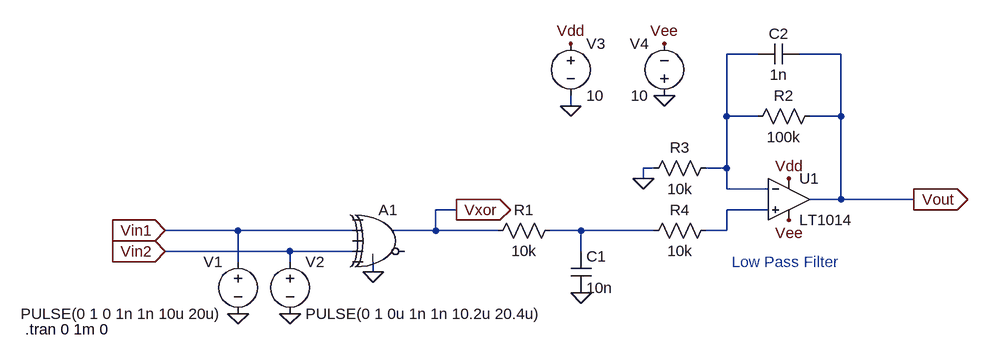
[diagram p0: schematic XOR phase detector.asc]
XOR phase detector.asc, the LTspice schematic file:
Version 4
SHEET 1 1552 680
WIRE 736 -128 688 -128
WIRE 864 -128 800 -128
WIRE 448 -48 448 -64
WIRE 688 -32 688 -128
WIRE 736 -32 688 -32
WIRE 864 -32 864 -128
WIRE 864 -32 816 -32
WIRE 576 48 560 48
WIRE 688 48 688 -32
WIRE 688 48 656 48
WIRE 560 64 560 48
WIRE 688 80 688 48
WIRE 752 80 688 80
WIRE 864 96 864 -32
WIRE 864 96 816 96
WIRE 976 96 864 96
WIRE 272 112 240 112
WIRE 752 112 688 112
WIRE -64 144 -176 144
WIRE 112 144 -64 144
WIRE 240 144 240 112
WIRE 240 144 176 144
WIRE 336 144 240 144
WIRE 464 144 416 144
WIRE 576 144 464 144
WIRE 688 144 688 112
WIRE 688 144 656 144
WIRE 16 176 -176 176
WIRE 112 176 16 176
WIRE 464 176 464 144
WIRE -64 192 -64 144
WIRE 16 192 16 176
WIRE 144 208 144 192
FLAG 144 208 0
FLAG -64 272 0
FLAG 16 272 0
FLAG 464 240 0
FLAG 784 64 Vdd
FLAG 976 96 Vout
IOPIN 976 96 Out
FLAG 784 128 Vee
FLAG 448 -48 0
FLAG 448 -144 Vdd
FLAG 592 -64 0
FLAG 592 -144 Vee
FLAG 560 64 0
FLAG -176 144 Vin1
IOPIN -176 144 In
FLAG -176 176 Vin2
IOPIN -176 176 In
FLAG 272 112 Vxor
IOPIN 272 112 Out
SYMBOL Digital\\xor 160 96 R0
SYMATTR InstName A1
SYMBOL voltage -64 176 M0
WINDOW 123 0 0 Left 0
WINDOW 39 0 0 Left 0
SYMATTR InstName V1
SYMATTR Value PULSE(0 1 0 1n 1n 10u 20u)
SYMBOL voltage 16 176 R0
WINDOW 123 0 0 Left 0
WINDOW 39 0 0 Left 0
SYMATTR InstName V2
SYMATTR Value PULSE(0 1 0u 1n 1n 10.2u 20.4u)
SYMBOL res 432 128 R90
WINDOW 0 0 56 VBottom 2
WINDOW 3 32 56 VTop 2
SYMATTR InstName R1
SYMATTR Value 10k
SYMBOL cap 448 176 R0
SYMATTR InstName C1
SYMATTR Value 10n
SYMBOL Opamps\\LT1014 784 32 R0
SYMATTR InstName U1
SYMBOL res 832 -48 R90
WINDOW 0 0 56 VBottom 2
WINDOW 3 32 56 VTop 2
SYMATTR InstName R2
SYMATTR Value 100k
SYMBOL res 672 32 R90
WINDOW 0 0 56 VBottom 2
WINDOW 3 32 56 VTop 2
SYMATTR InstName R3
SYMATTR Value 10k
SYMBOL res 672 128 R90
WINDOW 0 0 56 VBottom 2
WINDOW 3 32 56 VTop 2
SYMATTR InstName R4
SYMATTR Value 10k
SYMBOL cap 800 -144 R90
WINDOW 0 0 32 VBottom 2
WINDOW 3 32 32 VTop 2
SYMATTR InstName C2
SYMATTR Value 1n
SYMBOL voltage 448 -160 R0
WINDOW 123 0 0 Left 0
WINDOW 39 0 0 Left 0
SYMATTR InstName V3
SYMATTR Value 10
SYMBOL voltage 592 -48 R180
WINDOW 0 24 96 Left 2
WINDOW 3 24 16 Left 2
WINDOW 123 0 0 Left 0
WINDOW 39 0 0 Left 0
SYMATTR InstName V4
SYMATTR Value 10
TEXT -392 296 Left 2 !.tran 0 1m 0
TEXT 696 192 Left 2 ;Low Pass Filter

The netlist it stands for:
* XOR phase detector.asc
A1 0 Vin1 0 Vin2 0 0 Vxor 0 XOR
V1 Vin1 0 PULSE(0 1 0 1n 1n 10u 20u)
V2 Vin2 0 PULSE(0 1 0u 1n 1n 10.2u 20.4u)
R1 N003 Vxor 10k
C1 N003 0 10n
XU1 N002 N001 Vdd Vee Vout LT1014  ; pins In+ In- V+ V- OUT
R2 Vout N001 100k
R3 N001 0 10k
R4 N002 N003 10k
C2 Vout N001 1n
V3 Vdd 0 10
V4 0 Vee 10
.tran 0 1m 0
* Low Pass Filter
.backanno
.end